# EAGLE design Backplane (EAGLE 7.6.0)
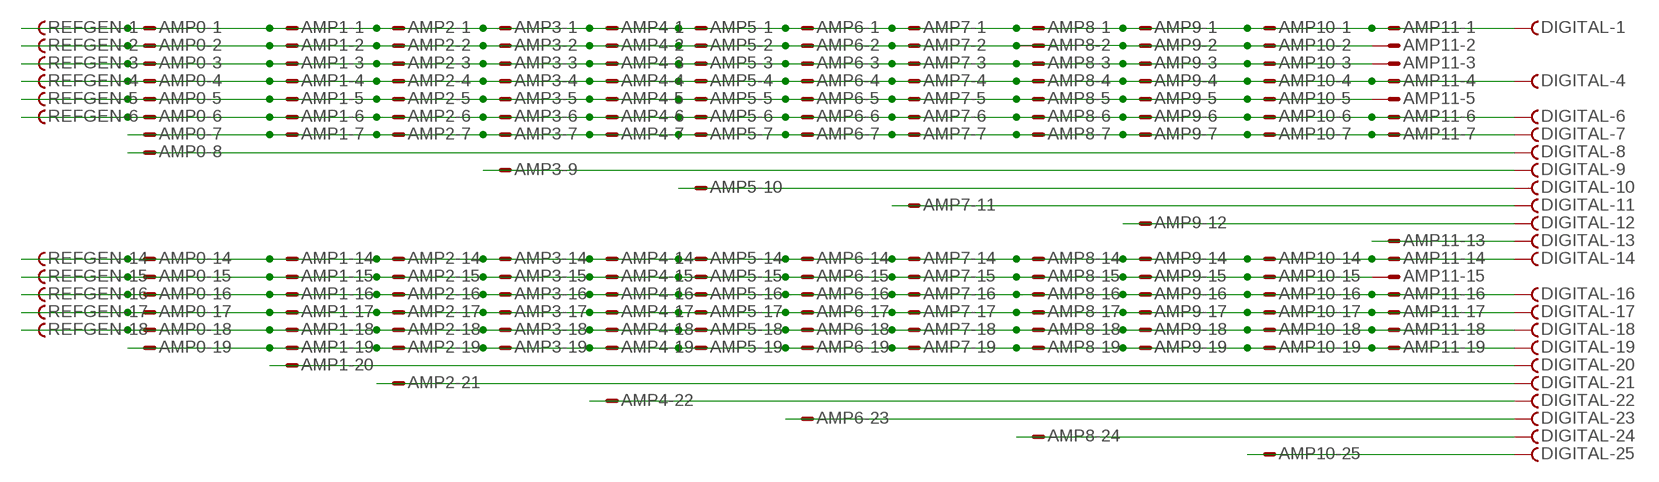
[diagram p0: schematic, sheet 1]

## Parts
AMP0  M25VPS  [M25VP]
AMP1  M25VPS  [M25VP]
AMP2  M25VPS  [M25VP]
AMP3  M25VPS  [M25VP]
AMP4  M25VPS  [M25VP]
AMP5  M25VPS  [M25VP]
AMP6  M25VPS  [M25VP]
AMP7  M25VPS  [M25VP]
AMP8  M25VPS  [M25VP]
AMP9  M25VPS  [M25VP]
AMP10  M25VPS  [M25VP]
AMP11  M25VPS  [M25VP]
DIGITAL  F25VPS  [F25VP]
REFGEN  F25VPS  [F25VP]

## Nets
N$1: AMP0.1 AMP1.1 AMP2.1 AMP3.1 AMP4.1 AMP5.1 AMP6.1 AMP7.1 AMP8.1 AMP9.1 AMP10.1 AMP11.1 DIGITAL.1 REFGEN.1
N$2: AMP0.2 AMP1.2 AMP2.2 AMP3.2 AMP4.2 AMP5.2 AMP6.2 AMP7.2 AMP8.2 AMP9.2 AMP10.2 AMP11.2 REFGEN.2
N$4: AMP0.3 AMP1.3 AMP2.3 AMP3.3 AMP4.3 AMP5.3 AMP6.3 AMP7.3 AMP8.3 AMP9.3 AMP10.3 AMP11.3 REFGEN.3
N$5: AMP0.4 AMP1.4 AMP2.4 AMP3.4 AMP4.4 AMP5.4 AMP6.4 AMP7.4 AMP8.4 AMP9.4 AMP10.4 AMP11.4 DIGITAL.4 REFGEN.4
N$6: AMP0.5 AMP1.5 AMP2.5 AMP3.5 AMP4.5 AMP5.5 AMP6.5 AMP7.5 AMP8.5 AMP9.5 AMP10.5 AMP11.5 REFGEN.5
N$7: AMP0.8 DIGITAL.8
N$8: AMP3.9 DIGITAL.9
N$9: AMP4.22 DIGITAL.22
N$10: AMP2.21 DIGITAL.21
N$11: AMP1.20 DIGITAL.20
N$12: AMP0.19 AMP1.19 AMP2.19 AMP3.19 AMP4.19 AMP5.19 AMP6.19 AMP7.19 AMP8.19 AMP9.19 AMP10.19 AMP11.19 DIGITAL.19
N$13: AMP5.10 DIGITAL.10
N$14: AMP0.6 AMP1.6 AMP2.6 AMP3.6 AMP4.6 AMP5.6 AMP6.6 AMP7.6 AMP8.6 AMP9.6 AMP10.6 AMP11.6 DIGITAL.6 REFGEN.6
N$15: AMP0.7 AMP1.7 AMP2.7 AMP3.7 AMP4.7 AMP5.7 AMP6.7 AMP7.7 AMP8.7 AMP9.7 AMP10.7 AMP11.7 DIGITAL.7
N$16: AMP6.23 DIGITAL.23
N$17: AMP7.11 DIGITAL.11
N$18: AMP8.24 DIGITAL.24
N$19: AMP9.12 DIGITAL.12
N$20: AMP0.14 AMP1.14 AMP2.14 AMP3.14 AMP4.14 AMP5.14 AMP6.14 AMP7.14 AMP8.14 AMP9.14 AMP10.14 AMP11.14 DIGITAL.14 REFGEN.14
N$21: AMP0.15 AMP1.15 AMP2.15 AMP3.15 AMP4.15 AMP5.15 AMP6.15 AMP7.15 AMP8.15 AMP9.15 AMP10.15 AMP11.15 REFGEN.15
N$22: AMP10.25 DIGITAL.25
N$23: AMP0.16 AMP1.16 AMP2.16 AMP3.16 AMP4.16 AMP5.16 AMP6.16 AMP7.16 AMP8.16 AMP9.16 AMP10.16 AMP11.16 DIGITAL.16 REFGEN.16
N$24: AMP0.17 AMP1.17 AMP2.17 AMP3.17 AMP4.17 AMP5.17 AMP6.17 AMP7.17 AMP8.17 AMP9.17 AMP10.17 AMP11.17 DIGITAL.17 REFGEN.17
N$25: AMP0.18 AMP1.18 AMP2.18 AMP3.18 AMP4.18 AMP5.18 AMP6.18 AMP7.18 AMP8.18 AMP9.18 AMP10.18 AMP11.18 DIGITAL.18 REFGEN.18
N$26: AMP11.13 DIGITAL.13
Unconnected: AMP0.9 AMP0.10 AMP0.11 AMP0.12 AMP0.13 AMP0.20 AMP0.21 AMP0.22 AMP0.23 AMP0.24 AMP0.25 AMP1.8 AMP1.9 AMP1.10 AMP1.11 AMP1.12 AMP1.13 AMP1.21 AMP1.22 AMP1.23 AMP1.24 AMP1.25 AMP2.8 AMP2.9 AMP2.10 AMP2.11 AMP2.12 AMP2.13 AMP2.20 AMP2.22 AMP2.23 AMP2.24 AMP2.25 AMP3.8 AMP3.10 AMP3.11 AMP3.12 AMP3.13 AMP3.20 AMP3.21 AMP3.22 AMP3.23 AMP3.24 AMP3.25 AMP4.8 AMP4.9 AMP4.10 AMP4.11 AMP4.12 AMP4.13 AMP4.20 AMP4.21 AMP4.23 AMP4.24 AMP4.25 AMP5.8 AMP5.9 AMP5.11 AMP5.12 AMP5.13 AMP5.20 AMP5.21 AMP5.22 AMP5.23 AMP5.24 AMP5.25 AMP6.8 AMP6.9 AMP6.10 AMP6.11 AMP6.12 AMP6.13 AMP6.20 AMP6.21 AMP6.22 AMP6.24 AMP6.25 AMP7.8 AMP7.9 AMP7.10 AMP7.12 AMP7.13 AMP7.20 AMP7.21 AMP7.22 AMP7.23 AMP7.24 AMP7.25 AMP8.8 AMP8.9 AMP8.10 AMP8.11 AMP8.12 AMP8.13 AMP8.20 AMP8.21 AMP8.22 AMP8.23 AMP8.25 AMP9.8 AMP9.9 AMP9.10 AMP9.11 AMP9.13 AMP9.20 AMP9.21 AMP9.22 AMP9.23 AMP9.24 AMP9.25 AMP10.8 AMP10.9 AMP10.10 AMP10.11 AMP10.12 AMP10.13 AMP10.20 AMP10.21 AMP10.22 AMP10.23 AMP10.24 AMP11.8 AMP11.9 AMP11.10 AMP11.11 AMP11.12 AMP11.20 AMP11.21 AMP11.22 AMP11.23 AMP11.24 AMP11.25 DIGITAL.2 DIGITAL.3 DIGITAL.5 DIGITAL.15 REFGEN.7 REFGEN.8 REFGEN.9 REFGEN.10 REFGEN.11 REFGEN.12 REFGEN.13 REFGEN.19 REFGEN.20 REFGEN.21 REFGEN.22 REFGEN.23 REFGEN.24 REFGEN.25

## Library data of the parts
AMP0 AMP1-AMP11 = con-subd:M25?S: SUB-D; OC_FARNELL: unknown; OC_NEWARK: unknown
DIGITAL REFGEN = con-subd:F25?S: SUB-D; OC_FARNELL: unknown; OC_NEWARK: unknown

## Board
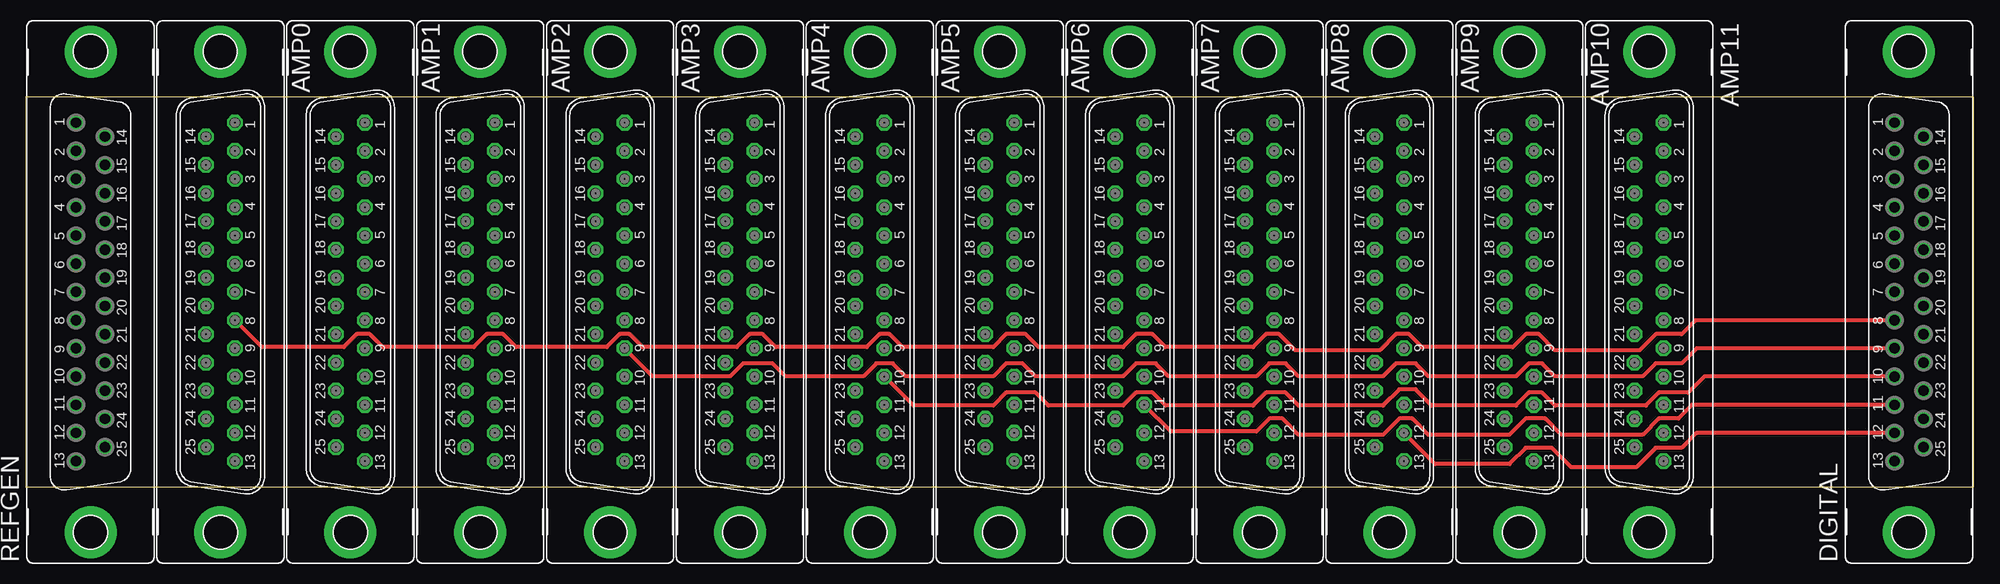
[diagram p1: board, top side]
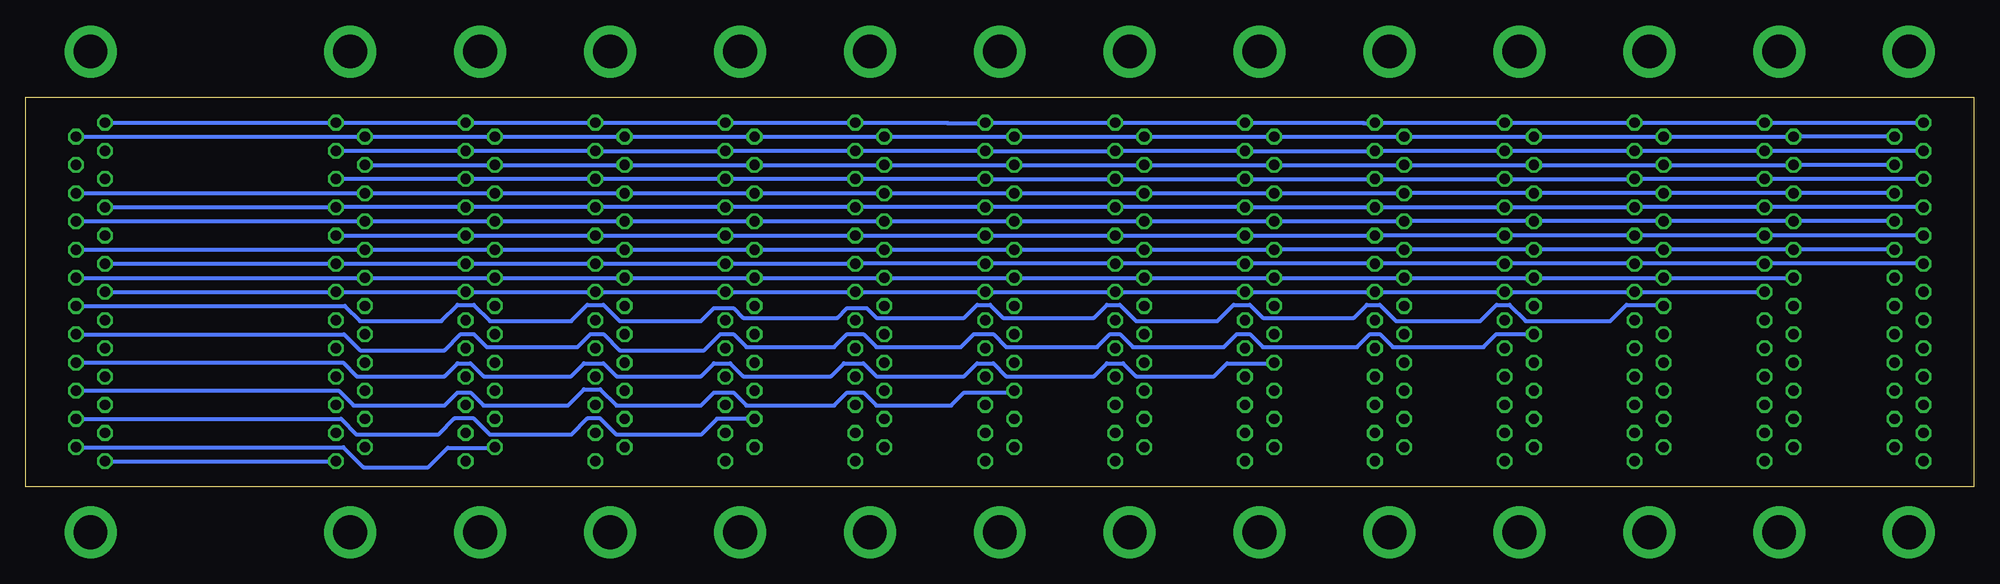
[diagram p2: board, bottom side, seen from below]

Size 190.5 x 38.1 mm. Coordinates in mm from the lower left corner, seen from the top.
Outline: 0,0 190.5,0 190.5,38.1 0,38.1 0,0
Copper layers (1*16): Top 0.0356mm / dielectric 1.5011mm / Bottom 0.0356mm
Design rules "Oshpark": minimum track width 6mil, minimum drill 13mil, track to track 6mil, track to pad 6mil, pad to pad 6mil, via to via 6mil, smd to smd 6mil, copper to edge 15mil, drill to drill 6mil, minimum pad ring 7mil, minimum via ring 7mil, stop-mask expansion 3mil, vias tented up to drill 0mil, thermal gap 10mil

### Footprints (pad centres in the part's own frame; a part is rotated, then mirrored left to right if it is on the bottom)
M25VP = drill 1.016 octagon: 1 -16.561,1.422; 2 -13.792,1.422; 3 -11.049,1.422; 4 -8.28,1.422; 5 -5.512,1.422; 6 -2.769,1.422; 7 0,1.422; 8 2.769,1.422; 9 5.512,1.422; 10 8.28,1.422; 11 11.049,1.422; 12 13.792,1.422; 13 16.561,1.422; 14 -15.189,-1.422; 15 -12.421,-1.422; 16 -9.652,-1.422; 17 -6.909,-1.422; 18 -4.14,-1.422; 19 -1.372,-1.422; 20 1.372,-1.422; 21 4.14,-1.422; 22 6.909,-1.422; 23 9.652,-1.422; 24 12.421,-1.422; 25 15.189,-1.422 | drill 3.302 pad 5.08: G1 -23.52,0; G2 23.52,0
F25VP = drill 1.016 octagon: 1 16.561,1.422; 2 13.792,1.422; 3 11.049,1.422; 4 8.28,1.422; 5 5.512,1.422; 6 2.769,1.422; 7 0,1.422; 8 -2.769,1.422; 9 -5.512,1.422; 10 -8.28,1.422; 11 -11.049,1.422; 12 -13.792,1.422; 13 -16.561,1.422; 14 15.189,-1.422; 15 12.421,-1.422; 16 9.652,-1.422; 17 6.909,-1.422; 18 4.14,-1.422; 19 1.372,-1.422; 20 -1.372,-1.422; 21 -4.14,-1.422; 22 -6.909,-1.422; 23 -9.652,-1.422; 24 -12.421,-1.422; 25 -15.189,-1.422 | drill 3.302 pad 5.08: G1 -23.52,0; G2 23.52,0

### Placement (x,y rotation side)
AMP0  19.05,19.05 270 top
AMP1  31.75,19.05 270 top
AMP2  44.45,19.05 270 top
AMP3  57.15,19.05 270 top
AMP4  69.85,19.05 270 top
AMP5  82.55,19.05 270 top
AMP6  95.25,19.05 270 top
AMP7  107.95,19.05 270 top
AMP8  120.65,19.05 270 top
AMP9  133.35,19.05 270 top
AMP10  146.05,19.05 270 top
AMP11  158.75,19.05 270 top
DIGITAL  184.15,19.05 90 top
REFGEN  6.35,19.05 90 top

### Tracks (layer width: path | path; a pad name or v marks a point on that pad's centre or on a via)
N$1
  Bottom 0.406: DIGITAL.1 AMP11.1 AMP10.1 AMP9.1 AMP8.1 AMP7.1 100.33,35.61 100.33,35.56 96.67,35.56 AMP6.1 AMP5.1 AMP4.1 59.69,35.61 59.69,35.56 58.57,35.56 AMP3.1 AMP2.1 AMP1.1 AMP0.1 REFGEN.1
N$2
  Bottom 0.406: AMP11.2 AMP10.2 AMP9.2 AMP8.2 AMP7.2 AMP6.2 AMP5.2 AMP4.2 AMP3.2 AMP2.2 AMP1.2 AMP0.2 REFGEN.2
N$4
  Bottom 0.406: AMP11.3 AMP10.3 AMP9.3 AMP8.3 AMP7.3 AMP6.3 AMP5.3 AMP4.3 AMP3.3 AMP2.3 AMP1.3 AMP0.3 REFGEN.3
N$5
  Bottom 0.406: DIGITAL.4 AMP11.4 AMP10.4 AMP9.4 AMP8.4 AMP7.4 AMP6.4 AMP5.4 AMP4.4 AMP3.4 AMP2.4 AMP1.4 AMP0.4 REFGEN.4
N$6
  Bottom 0.406: AMP11.5 AMP10.5 AMP9.5 AMP8.5 AMP7.5 AMP6.5 AMP5.5 AMP4.5 AMP3.5 AMP2.5 AMP1.5 AMP0.5 REFGEN.5
N$7
  Top 0.406: DIGITAL.8 163.28,16.28 161.93,14.92 159.38,14.92 157.8,13.34 149.54,13.34 147.96,14.92 146.69,14.92 145.41,13.65 136.53,13.65 135.25,14.92 133.99,14.92 132.4,13.34 124.14,13.34 122.56,14.92 121.28,14.92 120.02,13.65 111.44,13.65 110.17,14.92 108.58,14.92 107.31,13.65 99.06,13.65 97.79,14.92 95.89,14.92 94.61,13.65 85.72,13.65 84.45,14.92 83.5,14.92 82.23,13.65 73.34,13.65 72.07,14.92 70.8,14.92 69.53,13.65 60.33,13.65 59.05,14.92 58.1,14.92 56.83,13.65 47.94,13.65 46.67,14.92 45.09,14.92 43.81,13.65 34.92,13.65 33.66,14.92 32.38,14.92 31.11,13.65 23.1,13.65 AMP0.8
N$8
  Top 0.406: DIGITAL.9 163.4,13.54 161.93,12.07 159.38,12.07 158.12,10.79 149.54,10.79 148.27,12.07 147,12.07 145.73,10.79 137.16,10.79 135.89,12.07 133.99,12.07 132.72,10.79 124.46,10.79 123.19,12.07 121.6,12.07 120.33,10.79 111.76,10.79 110.49,12.07 108.58,12.07 107.31,10.79 98.74,10.79 97.47,12.07 95.89,12.07 94.61,10.79 86.04,10.79 84.77,12.07 83.19,12.07 81.92,10.79 74.3,10.79 73.03,12.07 70.17,12.07 68.9,10.79 61.32,10.79 AMP3.9
N$9
  Bottom 0.406: DIGITAL.22 159.46,12.14 158.12,10.79 149.54,10.79 148.27,12.07 147,12.07 145.73,10.79 137.16,10.79 135.89,12.07 133.99,12.07 132.72,10.79 124.46,10.79 123.19,12.07 121.6,12.07 120.33,10.79 111.76,10.79 110.49,12.07 108.58,12.07 107.31,10.79 98.74,10.79 97.47,12.07 95.89,12.07 94.61,10.79 86.04,10.79 84.77,12.07 83.19,12.07 81.92,10.79 74.3,10.79 73.03,12.07 68.5,12.07 AMP4.22
N$10
  Bottom 0.406: DIGITAL.21 159.37,14.91 157.8,13.34 149.54,13.34 147.96,14.92 146.69,14.92 145.41,13.65 136.53,13.65 135.25,14.92 133.99,14.92 132.4,13.34 124.14,13.34 122.56,14.92 121.28,14.92 120.02,13.65 111.44,13.65 110.17,14.92 108.58,14.92 107.31,13.65 99.06,13.65 97.79,14.92 95.89,14.92 94.61,13.65 85.72,13.65 84.45,14.92 83.5,14.92 82.23,13.65 73.34,13.65 72.07,14.92 70.8,14.92 69.53,13.65 60.33,13.65 59.05,14.92 58.1,14.92 56.83,13.65 47.94,13.65 46.67,14.92 43.04,14.92 AMP2.21
N$11
  Bottom 0.406: DIGITAL.20 159.28,17.68 157.8,16.19 149.86,16.19 148.27,17.78 146.69,17.78 145.1,16.19 137.16,16.19 135.57,17.78 133.99,17.78 132.4,16.19 124.46,16.19 123.19,17.46 121.28,17.46 120.33,16.51 111.12,16.51 110.17,17.46 108.27,17.46 107.31,16.51 98.74,16.51 97.47,17.78 96.2,17.78 94.93,16.51 86.04,16.51 84.77,17.78 83.5,17.78 81.92,16.19 73.98,16.19 72.39,17.78 70.8,17.78 69.53,16.51 60.64,16.51 59.37,17.78 58.1,17.78 56.52,16.19 48.26,16.19 46.67,17.78 45.4,17.78 43.81,16.19 35.56,16.19 33.97,17.78 30.43,17.78 AMP1.20
N$12
  Bottom 0.406: DIGITAL.19 AMP11.19 AMP10.19 AMP9.19 AMP8.19 AMP7.19 AMP6.19 AMP5.19 AMP4.19 AMP3.19 AMP2.19 AMP1.19 AMP0.19
N$13
  Top 0.406: DIGITAL.10 164.12,10.77 162.56,9.21 159.7,9.21 158.43,7.94 149.54,7.94 148.27,9.21 147,9.21 145.73,7.94 137.48,7.94 135.89,9.52 134.3,9.52 132.72,7.94 124.46,7.94 123.19,9.21 121.28,9.21 120.02,7.94 111.44,7.94 110.17,9.21 108.58,9.21 107.31,7.94 100.01,7.94 98.74,9.21 95.89,9.21 94.61,7.94 86.81,7.94 AMP5.10
N$14
  Bottom 0.406: REFGEN.6 AMP0.6 AMP1.6 AMP2.6 AMP3.6 AMP4.6 AMP5.6 AMP6.6 AMP7.6 AMP8.6 AMP9.6 AMP10.6 AMP11.6 DIGITAL.6
N$15
  Bottom 0.406: DIGITAL.7 AMP11.7 AMP10.7 AMP9.7 AMP8.7 AMP7.7 AMP6.7 AMP5.7 AMP4.7 AMP3.7 AMP2.7 AMP1.7 AMP0.7
N$16
  Bottom 0.406: DIGITAL.23 159.89,9.4 158.43,7.94 149.54,7.94 148.27,9.21 147,9.21 145.73,7.94 137.48,7.94 135.89,9.52 134.3,9.52 132.72,7.94 124.46,7.94 123.19,9.21 121.28,9.21 120.02,7.94 111.44,7.94 110.17,9.21 108.58,9.21 107.31,7.94 100.01,7.94 98.74,9.21 94.02,9.21 AMP6.23
N$17
  Top 0.406: DIGITAL.11 162.94,8 161.61,6.67 159.7,6.67 158.12,5.08 150.18,5.08 148.59,6.67 146.69,6.67 145.1,5.08 137.16,5.08 135.57,6.67 134.3,6.67 132.72,5.08 124.46,5.08 122.87,6.67 121.6,6.67 120.33,5.4 111.98,5.4 AMP7.11
N$18
  Bottom 0.406: DIGITAL.24 159.66,6.63 158.12,5.08 150.18,5.08 148.59,6.67 146.69,6.67 145.1,5.08 137.16,5.08 135.57,6.67 134.3,6.67 132.72,5.08 124.46,5.08 122.91,6.63 AMP8.24
N$19
  Top 0.406: DIGITAL.12 163.37,5.26 161.93,3.81 159.38,3.81 157.48,1.9 151.13,1.9 149.22,3.81 146.69,3.81 145.1,2.22 137.81,2.22 AMP9.12
N$20
  Bottom 0.406: DIGITAL.14 AMP11.14 AMP10.14 AMP9.14 AMP8.14 AMP7.14 AMP6.14 AMP5.14 AMP4.14 AMP3.14 AMP2.14 AMP1.14 AMP0.14 REFGEN.14
N$21
  Bottom 0.406: AMP11.15 AMP10.15 AMP9.15 AMP8.15 AMP7.15 AMP6.15 AMP5.15 AMP4.15 AMP3.15 AMP2.15 AMP1.15 AMP0.15 REFGEN.15
N$22
  Bottom 0.406: DIGITAL.25 159.44,3.86 157.48,1.9 151.13,1.9 149.22,3.81 144.68,3.81 AMP10.25
N$23
  Bottom 0.406: DIGITAL.16 AMP11.16 AMP10.16 AMP9.16 AMP8.16 AMP7.16 AMP6.16 AMP5.16 AMP4.16 AMP3.16 AMP2.16 AMP1.16 AMP0.16 REFGEN.16
N$24
  Bottom 0.406: DIGITAL.17 AMP11.17 AMP10.17 AMP9.17 AMP8.17 AMP7.17 AMP6.17 AMP5.17 AMP4.17 AMP3.17 AMP2.17 AMP1.17 AMP0.17 REFGEN.17
N$25
  Bottom 0.406: DIGITAL.18 AMP11.18 AMP10.18 AMP9.18 AMP8.18 AMP7.18 AMP6.18 AMP5.18 AMP4.18 AMP3.18 AMP2.18 AMP1.18 AMP0.18 REFGEN.18
N$26
  Bottom 0.406: DIGITAL.13 AMP11.13